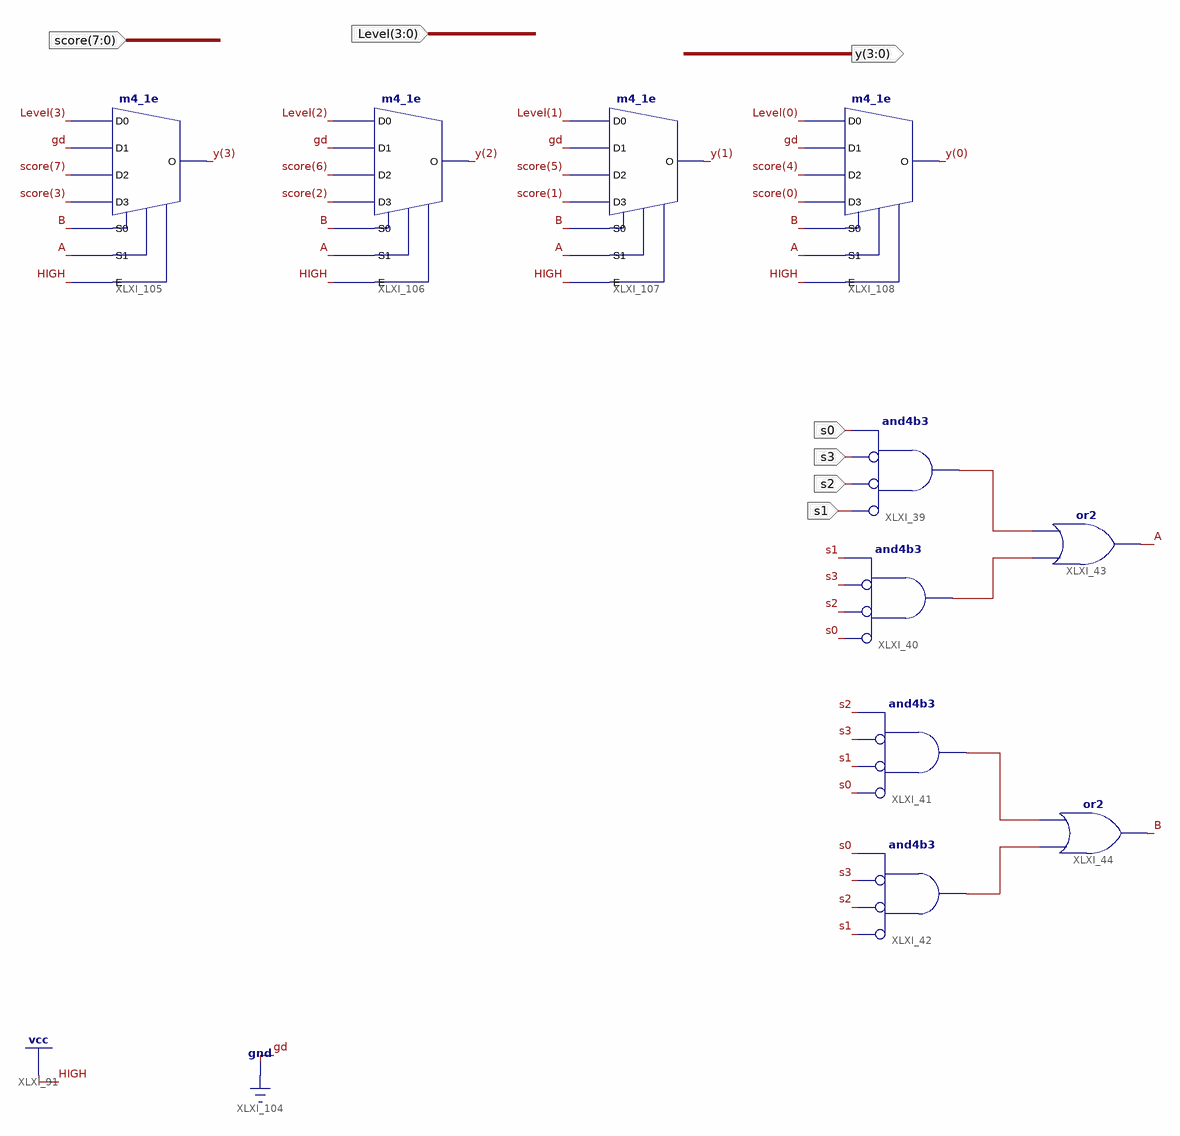
[diagram p0: schematic sheet 1]
// Xilinx ISE schematic Selector.sch (spartan3e) as structural Verilog: 10 symbols, 7 ports
module Selector (
  input  [3:0] Level,
  input  [7:0] score,
  input  s1,
  input  s2,
  input  s3,
  input  s0,
  output [3:0] y
);

  wire A, B, XLXN_119, XLXN_120, XLXN_121, XLXN_122;

  m4_1e XLXI_105 (.D0(Level[3]), .D1(1'b0), .D2(score[7]), .D3(score[3]), .E(1'b1), .S0(B), .S1(A), .O(y[3]));
  m4_1e XLXI_106 (.D0(Level[2]), .D1(1'b0), .D2(score[6]), .D3(score[2]), .E(1'b1), .S0(B), .S1(A), .O(y[2]));
  m4_1e XLXI_107 (.D0(Level[1]), .D1(1'b0), .D2(score[5]), .D3(score[1]), .E(1'b1), .S0(B), .S1(A), .O(y[1]));
  m4_1e XLXI_108 (.D0(Level[0]), .D1(1'b0), .D2(score[4]), .D3(score[0]), .E(1'b1), .S0(B), .S1(A), .O(y[0]));
  or XLXI_44 (B, XLXN_122, XLXN_121);
  and XLXI_42 (XLXN_122, ~s1, ~s2, ~s3, s0);  // and4b3
  and XLXI_41 (XLXN_121, ~s0, ~s1, ~s3, s2);  // and4b3
  or XLXI_43 (A, XLXN_120, XLXN_119);
  and XLXI_40 (XLXN_120, ~s0, ~s2, ~s3, s1);  // and4b3
  and XLXI_39 (XLXN_119, ~s1, ~s2, ~s3, s0);  // and4b3
endmodule
